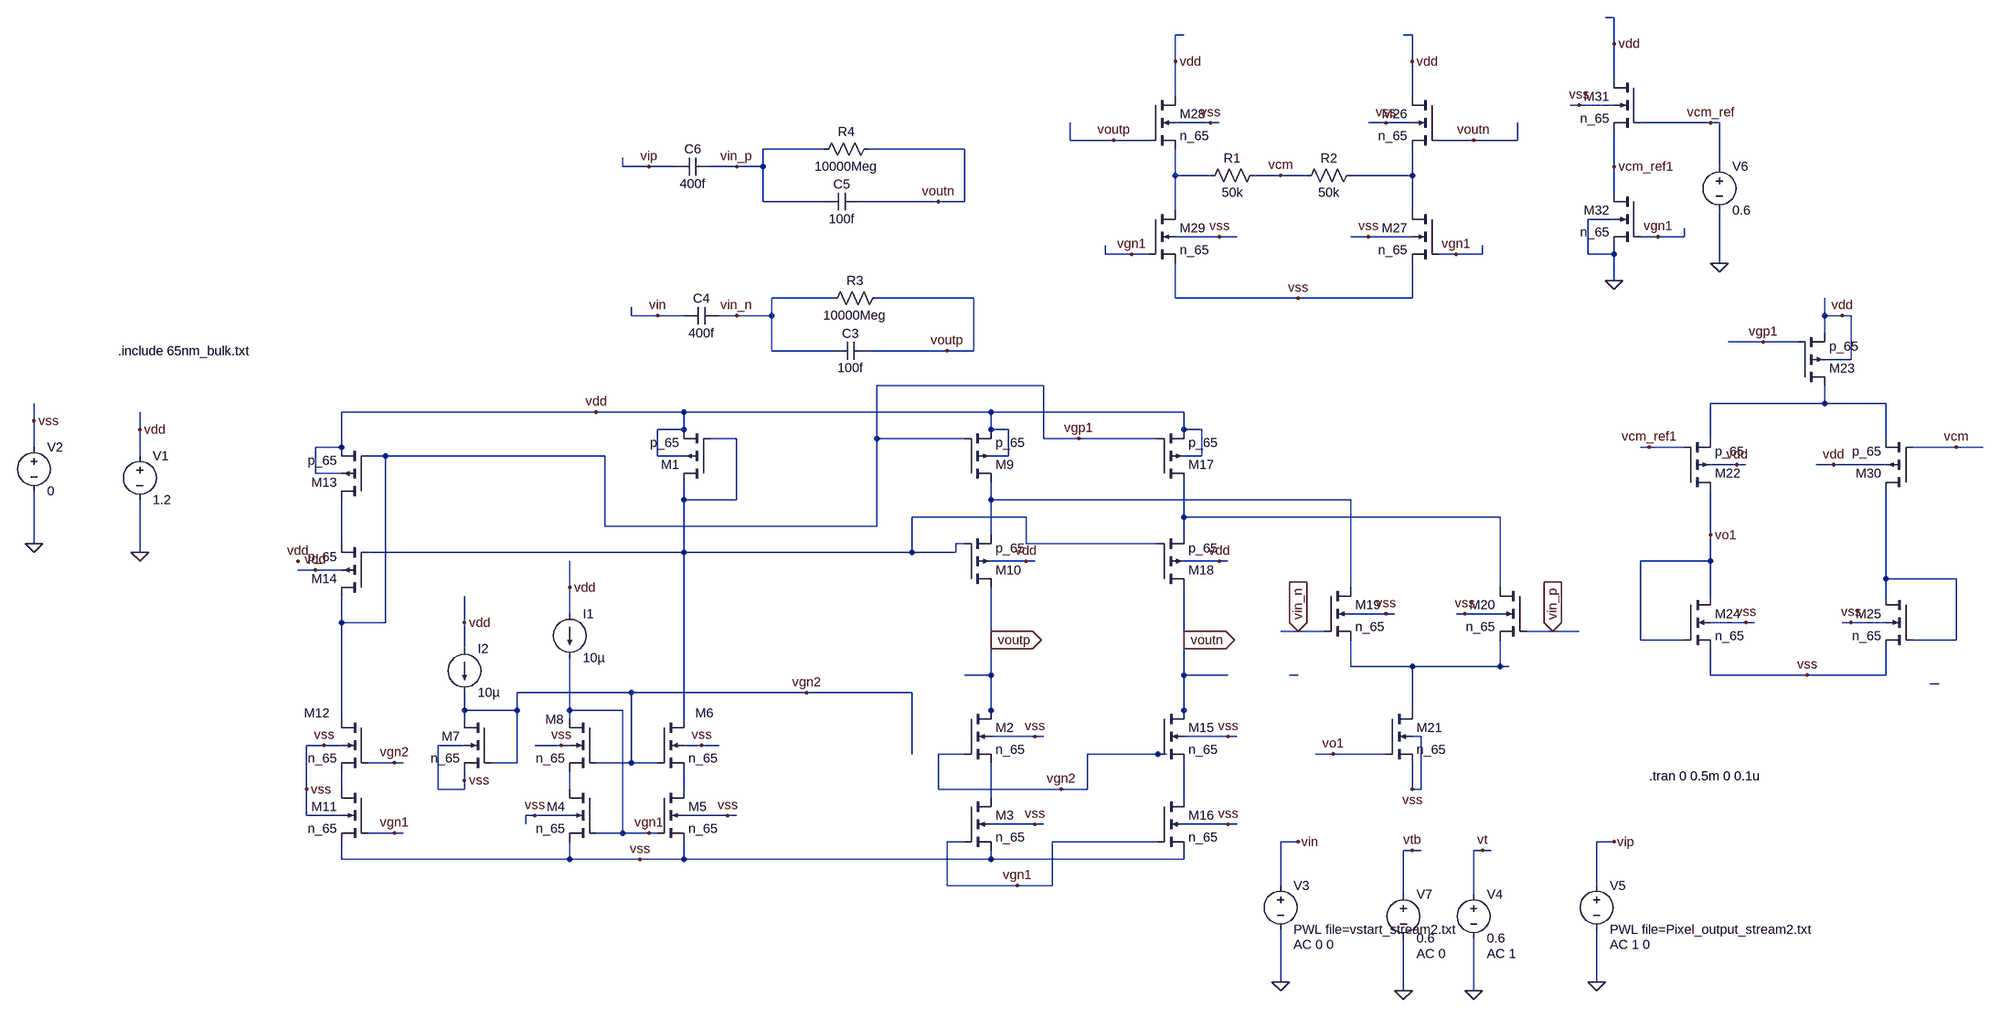
[diagram p0: schematic FullyDiff_STBAnalysis.asc]
FullyDiff_STBAnalysis.asc, the LTspice schematic file:
Version 4
SHEET 1 1972 1008
WIRE 976 -816 960 -816
WIRE 192 -784 176 -784
WIRE 608 -784 592 -784
WIRE 976 -768 976 -816
WIRE 176 -736 176 -784
WIRE 608 -736 608 -784
WIRE 976 -704 976 -768
WIRE 176 -672 176 -736
WIRE 608 -672 608 -736
WIRE 912 -656 896 -656
WIRE 976 -656 912 -656
WIRE 240 -624 176 -624
WIRE 256 -624 240 -624
WIRE 560 -624 528 -624
WIRE 608 -624 560 -624
WIRE 1152 -624 1024 -624
WIRE 1168 -624 1152 -624
WIRE -16 -592 -16 -624
WIRE 64 -592 -16 -592
WIRE 128 -592 64 -592
WIRE 720 -592 656 -592
WIRE 800 -592 800 -624
WIRE 800 -592 720 -592
WIRE -464 -576 -576 -576
WIRE -208 -576 -384 -576
WIRE -832 -544 -832 -560
WIRE -784 -544 -832 -544
WIRE -736 -544 -784 -544
WIRE -624 -544 -672 -544
WIRE -576 -544 -576 -576
WIRE -576 -544 -624 -544
WIRE 976 -544 976 -608
WIRE 1168 -544 1168 -624
WIRE 176 -528 176 -576
WIRE 240 -528 176 -528
WIRE 368 -528 320 -528
WIRE 416 -528 368 -528
WIRE 608 -528 608 -576
WIRE 608 -528 496 -528
WIRE 976 -496 976 -544
WIRE -576 -480 -576 -544
WIRE -464 -480 -576 -480
WIRE -256 -480 -400 -480
WIRE -208 -480 -208 -576
WIRE -208 -480 -256 -480
WIRE 176 -464 176 -528
WIRE 608 -464 608 -528
WIRE 976 -448 928 -448
WIRE 256 -416 176 -416
WIRE 288 -416 256 -416
WIRE 528 -416 496 -416
WIRE 608 -416 528 -416
WIRE 1056 -416 1024 -416
WIRE 1104 -416 1104 -432
WIRE 1104 -416 1056 -416
WIRE 48 -384 48 -400
WIRE 96 -384 48 -384
WIRE 128 -384 96 -384
WIRE 688 -384 656 -384
WIRE 736 -384 736 -400
WIRE 736 -384 688 -384
WIRE 928 -384 928 -448
WIRE 976 -384 976 -400
WIRE 976 -384 928 -384
WIRE 1168 -368 1168 -464
WIRE 976 -336 976 -384
WIRE -448 -304 -560 -304
WIRE -192 -304 -368 -304
WIRE 176 -304 176 -368
WIRE 400 -304 176 -304
WIRE 608 -304 608 -368
WIRE 608 -304 400 -304
WIRE -816 -272 -816 -288
WIRE -768 -272 -816 -272
WIRE -720 -272 -768 -272
WIRE -624 -272 -656 -272
WIRE -560 -272 -560 -304
WIRE -560 -272 -624 -272
WIRE 1360 -272 1360 -304
WIRE 1392 -272 1360 -272
WIRE 1408 -272 1392 -272
WIRE 1360 -240 1360 -272
WIRE 1248 -224 1184 -224
WIRE 1312 -224 1248 -224
WIRE -560 -208 -560 -272
WIRE -448 -208 -560 -208
WIRE -240 -208 -384 -208
WIRE -192 -208 -192 -304
WIRE -192 -208 -240 -208
WIRE 1408 -192 1408 -272
WIRE 1408 -192 1360 -192
WIRE -64 -144 -368 -144
WIRE 1360 -112 1360 -144
WIRE 1360 -112 1152 -112
WIRE 1472 -112 1360 -112
WIRE -880 -96 -1344 -96
WIRE -720 -96 -880 -96
WIRE -160 -96 -720 -96
WIRE 192 -96 -160 -96
WIRE -1920 -80 -1920 -112
WIRE -1712 -64 -1712 -96
WIRE -720 -64 -720 -96
WIRE -720 -64 -768 -64
WIRE -160 -64 -160 -96
WIRE -128 -64 -160 -64
WIRE 192 -64 192 -96
WIRE 224 -64 192 -64
WIRE -624 -48 -672 -48
WIRE -368 -48 -368 -144
WIRE -208 -48 -368 -48
WIRE -64 -48 -64 -144
WIRE 0 -48 -64 -48
WIRE 144 -48 0 -48
WIRE 1152 -48 1152 -112
WIRE 1472 -48 1472 -112
WIRE -1920 -32 -1920 -80
WIRE -1344 -32 -1344 -96
WIRE -1344 -32 -1392 -32
WIRE 1040 -32 1024 -32
WIRE 1104 -32 1040 -32
WIRE 1600 -32 1520 -32
WIRE 1648 -32 1600 -32
WIRE -1712 -16 -1712 -64
WIRE -1344 -16 -1344 -32
WIRE -1264 -16 -1296 -16
WIRE -864 -16 -1264 -16
WIRE -768 -16 -768 -64
WIRE -720 -16 -768 -16
WIRE -128 -16 -128 -64
WIRE -128 -16 -160 -16
WIRE 224 -16 224 -64
WIRE 224 -16 192 -16
WIRE 1200 0 1152 0
WIRE 1216 0 1200 0
WIRE 1376 0 1344 0
WIRE 1472 0 1376 0
WIRE -1392 16 -1392 -32
WIRE -1344 16 -1392 16
WIRE -720 64 -720 32
WIRE -624 64 -624 -48
WIRE -624 64 -720 64
WIRE -160 64 -160 32
WIRE 496 64 -160 64
WIRE -96 96 -304 96
WIRE 192 96 192 32
WIRE 768 96 192 96
WIRE -864 112 -864 -16
WIRE -368 112 -368 -48
WIRE -368 112 -864 112
WIRE -160 128 -160 64
WIRE 192 128 192 96
WIRE 1152 128 1152 48
WIRE -1920 144 -1920 48
WIRE -1344 144 -1344 64
WIRE -208 144 -224 144
WIRE -96 144 -96 96
WIRE 144 144 -96 144
WIRE -1712 160 -1712 64
WIRE -720 160 -720 64
WIRE -720 160 -1296 160
WIRE -304 160 -304 96
WIRE -304 160 -720 160
WIRE -224 160 -224 144
WIRE -224 160 -304 160
WIRE -96 176 -160 176
WIRE -80 176 -96 176
WIRE 256 176 192 176
WIRE 272 176 256 176
WIRE 1152 176 1152 128
WIRE 1152 176 1024 176
WIRE -1392 192 -1424 192
WIRE -1344 192 -1392 192
WIRE 1472 208 1472 48
WIRE 1600 208 1472 208
WIRE -928 224 -928 176
WIRE 496 224 496 64
WIRE 768 224 768 96
WIRE 1152 240 1152 176
WIRE 1472 240 1472 208
WIRE -928 272 -928 224
WIRE 560 272 496 272
WIRE 576 272 560 272
WIRE 704 272 688 272
WIRE 768 272 704 272
WIRE -1344 288 -1344 240
WIRE -1264 288 -1264 -16
WIRE -1264 288 -1344 288
WIRE -1120 288 -1120 240
WIRE 1216 288 1152 288
WIRE 1232 288 1216 288
WIRE 1408 288 1392 288
WIRE 1472 288 1408 288
WIRE 400 304 368 304
WIRE 448 304 400 304
WIRE 864 304 816 304
WIRE 912 304 864 304
WIRE -160 320 -160 224
WIRE 192 320 192 224
WIRE 1024 320 1024 176
WIRE 1104 320 1024 320
WIRE 1600 320 1600 208
WIRE 1600 320 1520 320
WIRE -1120 336 -1120 288
WIRE 496 368 496 320
WIRE 608 368 496 368
WIRE 768 368 768 320
WIRE 768 368 608 368
WIRE 784 368 768 368
WIRE -160 384 -160 320
WIRE -160 384 -208 384
WIRE 192 384 192 320
WIRE 272 384 192 384
WIRE 400 384 384 384
WIRE 1152 384 1152 336
WIRE 1328 384 1152 384
WIRE 1472 384 1472 336
WIRE 1472 384 1328 384
WIRE 1568 400 1552 400
WIRE -816 416 -1024 416
WIRE -496 416 -816 416
WIRE -304 416 -496 416
WIRE -1120 448 -1120 416
WIRE -1024 448 -1024 416
WIRE -1024 448 -1120 448
WIRE -928 448 -928 352
WIRE -832 448 -928 448
WIRE -160 448 -160 384
WIRE 192 448 192 384
WIRE 608 448 608 368
WIRE -1344 464 -1344 288
WIRE -1120 464 -1120 448
WIRE -928 464 -928 448
WIRE -720 464 -720 160
WIRE -160 464 -160 448
WIRE 192 464 192 448
WIRE -80 496 -160 496
WIRE -64 496 -80 496
WIRE 272 496 192 496
WIRE 288 496 272 496
WIRE 624 496 608 496
WIRE -1376 512 -1408 512
WIRE -1344 512 -1376 512
WIRE -1120 512 -1168 512
WIRE -944 512 -992 512
WIRE -928 512 -944 512
WIRE -688 512 -720 512
WIRE -656 512 -688 512
WIRE -304 528 -304 416
WIRE -208 528 -256 528
WIRE 144 528 16 528
WIRE 160 528 144 528
WIRE 464 528 432 528
WIRE 560 528 464 528
WIRE -1248 544 -1296 544
WIRE -1232 544 -1248 544
WIRE -1024 544 -1024 448
WIRE -1024 544 -1072 544
WIRE -816 544 -816 416
WIRE -816 544 -880 544
WIRE -768 544 -816 544
WIRE -1120 576 -1120 560
WIRE -1408 592 -1408 512
WIRE -1344 592 -1344 560
WIRE -1168 592 -1168 512
WIRE -1120 592 -1120 576
WIRE -1120 592 -1168 592
WIRE -928 592 -928 560
WIRE -720 592 -720 560
WIRE -256 592 -256 528
WIRE -32 592 -256 592
WIRE 16 592 16 528
WIRE 16 592 -32 592
WIRE 608 592 608 544
WIRE 624 592 624 496
WIRE 624 592 608 592
WIRE -160 608 -160 544
WIRE 192 608 192 544
WIRE -1408 640 -1408 592
WIRE -1344 640 -1408 640
WIRE -992 640 -1008 640
WIRE -928 640 -992 640
WIRE -640 640 -720 640
WIRE -624 640 -640 640
WIRE -1008 656 -1008 640
WIRE -80 656 -160 656
WIRE -64 656 -80 656
WIRE 272 656 192 656
WIRE 288 656 272 656
WIRE -1248 672 -1296 672
WIRE -1232 672 -1248 672
WIRE -832 672 -832 448
WIRE -832 672 -880 672
WIRE -784 672 -832 672
WIRE -768 672 -784 672
WIRE -208 688 -240 688
WIRE 144 688 -48 688
WIRE 400 688 368 688
WIRE 976 688 944 688
WIRE 608 704 592 704
WIRE 624 704 608 704
WIRE 736 704 720 704
WIRE 752 704 736 704
WIRE -1344 720 -1344 688
WIRE -928 720 -928 688
WIRE -928 720 -1344 720
WIRE -800 720 -928 720
WIRE -720 720 -720 688
WIRE -720 720 -800 720
WIRE -160 720 -160 704
WIRE -160 720 -720 720
WIRE 192 720 192 704
WIRE 192 720 -160 720
WIRE -240 768 -240 688
WIRE -112 768 -240 768
WIRE -48 768 -48 688
WIRE -48 768 -112 768
WIRE 368 768 368 688
WIRE 944 768 944 688
WIRE 592 784 592 704
WIRE 720 784 720 704
WIRE 368 944 368 848
WIRE 944 944 944 848
WIRE 592 960 592 864
WIRE 720 960 720 864
FLAG -928 224 vdd
FLAG -80 496 vss
FLAG -80 656 vss
FLAG -688 512 vss
FLAG -800 720 vss
FLAG -1120 288 vdd
FLAG -1120 576 vss
FLAG -944 512 vss
FLAG -96 176 vdd
FLAG -1376 512 vss
FLAG -1248 672 vgn1
FLAG -1248 544 vgn2
FLAG -880 -96 vdd
FLAG -1712 160 0
FLAG -1712 -64 vdd
FLAG -1920 144 0
FLAG -1920 -80 vss
FLAG -160 320 voutp
IOPIN -160 320 Out
FLAG 272 496 vss
FLAG 272 656 vss
FLAG 256 176 vdd
FLAG 192 320 voutn
IOPIN 192 320 Out
FLAG 560 272 vss
FLAG 704 272 vss
FLAG 608 592 vss
FLAG 1328 384 vss
FLAG 1216 288 vss
FLAG 1408 288 vss
FLAG 1392 -272 vdd
FLAG 1200 0 vdd
FLAG 864 304 vin_p
IOPIN 864 304 In
FLAG 400 304 vin_n
IOPIN 400 304 In
FLAG 0 -48 vgp1
FLAG 368 944 0
FLAG 400 688 vin
FLAG 944 944 0
FLAG 976 688 vip
FLAG -496 416 vgn2
FLAG -112 768 vgn1
FLAG -32 592 vgn2
FLAG 608 -736 vdd
FLAG 688 -384 vgn1
FLAG 720 -592 voutn
FLAG 176 -736 vdd
FLAG 96 -384 vgn1
FLAG 64 -592 voutp
FLAG 400 -304 vss
FLAG 368 -528 vcm
FLAG 1376 0 vdd
FLAG 1600 -32 vcm
FLAG 1248 -224 vgp1
FLAG -784 672 vgn1
FLAG 976 -768 vdd
FLAG 1056 -416 vgn1
FLAG 1168 -368 0
FLAG 1152 -624 vcm_ref
FLAG 976 -544 vcm_ref1
FLAG 1040 -32 vcm_ref1
FLAG 976 -336 0
FLAG 736 704 vt
FLAG 1152 128 vo1
FLAG 464 528 vo1
FLAG -1424 176 vdd
FLAG -1392 192 vdd
FLAG -624 -544 vin_p
FLAG -624 -272 vin_n
FLAG -784 -544 vip
FLAG -768 -272 vin
FLAG 592 960 0
FLAG 608 704 vtb
FLAG 720 960 0
FLAG -256 -480 voutn
FLAG -240 -208 voutp
FLAG 240 -624 vss
FLAG 256 -416 vss
FLAG 528 -416 vss
FLAG 560 -624 vss
FLAG 912 -656 vss
FLAG -1408 592 vss
FLAG -640 640 vss
FLAG -992 640 vss
DATAFLAG -384 416 ""
DATAFLAG -304 160 ""
DATAFLAG -48 -64 ""
DATAFLAG 192 -80 ""
DATAFLAG 1200 -112 ""
DATAFLAG 1152 96 ""
DATAFLAG 1472 160 ""
DATAFLAG -160 272 ""
DATAFLAG 192 272 ""
DATAFLAG 1344 320 ""
DATAFLAG 608 96 ""
DATAFLAG -80 64 ""
DATAFLAG 192 592 ""
DATAFLAG -160 592 ""
DATAFLAG 608 576 ""
DATAFLAG -192 688 ""
DATAFLAG 48 144 ""
DATAFLAG 32 672 ""
DATAFLAG 176 -560 ""
DATAFLAG 608 -544 ""
DATAFLAG 0 -592 ""
DATAFLAG 800 -608 ""
DATAFLAG -1280 544 ""
DATAFLAG -864 544 ""
DATAFLAG -976 -16 ""
DATAFLAG -1024 160 ""
DATAFLAG -1344 80 ""
DATAFLAG 1088 -640 ""
DATAFLAG 1136 208 ""
DATAFLAG 496 112 ""
DATAFLAG 608 416 ""
DATAFLAG 480 512 ""
DATAFLAG 192 272 ""
DATAFLAG -528 -304 ""
DATAFLAG -256 -304 ""
DATAFLAG -224 -528 ""
DATAFLAG -512 -576 ""
DATAFLAG -208 -256 ""
DATAFLAG 688 960 ""
DATAFLAG -1408 512 ""
DATAFLAG -176 384 ""
DATAFLAG 96 -48 ""
DATAFLAG -640 112 ""
DATAFLAG -256 -144 ""
DATAFLAG -432 -96 ""
DATAFLAG 64 688 ""
DATAFLAG 64 528 ""
DATAFLAG -288 -576 "$"
SYMBOL pmos4 -672 32 R180
SYMATTR InstName M1
SYMATTR Value p_65
SYMATTR Value2 l=200n w=2.5u
SYMBOL nmos4 -208 448 R0
SYMATTR InstName M2
SYMATTR Value n_65
SYMATTR Value2 l=200n w=10u
SYMBOL nmos4 -208 608 R0
SYMATTR InstName M3
SYMATTR Value n_65
SYMATTR Value2 l=200n w=10u
SYMBOL nmos4 -880 592 M0
SYMATTR InstName M4
SYMATTR Value n_65
SYMATTR Value2 l=200n w=10u
SYMBOL current -928 272 R0
WINDOW 123 0 0 Left 0
WINDOW 39 0 0 Left 0
SYMATTR InstName I1
SYMATTR Value 10µ
SYMBOL nmos4 -768 592 R0
SYMATTR InstName M5
SYMATTR Value n_65
SYMATTR Value2 l=200n w=10u
SYMBOL nmos4 -768 464 R0
WINDOW 0 69 -11 Left 2
SYMATTR InstName M6
SYMATTR Value n_65
SYMATTR Value2 l=200n w=10u
SYMBOL nmos4 -1072 464 M0
SYMATTR InstName M7
SYMATTR Value n_65
SYMATTR Value2 l=200n w=2.5u
SYMBOL current -1120 336 R0
WINDOW 123 0 0 Left 0
WINDOW 39 0 0 Left 0
SYMATTR InstName I2
SYMATTR Value 10µ
SYMBOL nmos4 -880 464 M0
WINDOW 0 59 1 Left 2
SYMATTR InstName M8
SYMATTR Value n_65
SYMATTR Value2 l=200n w=10u
SYMBOL pmos4 -208 32 M180
SYMATTR InstName M9
SYMATTR Value p_65
SYMATTR Value2 l=200n w=20u
SYMBOL pmos4 -208 224 M180
SYMATTR InstName M10
SYMATTR Value p_65
SYMATTR Value2 l=200n w=10u
SYMBOL nmos4 -1296 592 M0
SYMATTR InstName M11
SYMATTR Value n_65
SYMATTR Value2 l=200n w=10u
SYMBOL nmos4 -1296 464 M0
WINDOW 0 69 -11 Left 2
SYMATTR InstName M12
SYMATTR Value n_65
SYMATTR Value2 l=200n w=10u
SYMBOL pmos4 -1296 64 R180
SYMATTR InstName M13
SYMATTR Value p_65
SYMATTR Value2 l=200n w=10u
SYMBOL pmos4 -1296 240 R180
SYMATTR InstName M14
SYMATTR Value p_65
SYMATTR Value2 l=200n w=10u
SYMBOL voltage -1712 -32 R0
WINDOW 123 0 0 Left 0
WINDOW 39 0 0 Left 0
SYMATTR InstName V1
SYMATTR Value 1.2
SYMBOL voltage -1920 -48 R0
WINDOW 123 0 0 Left 0
WINDOW 39 0 0 Left 0
SYMATTR InstName V2
SYMATTR Value 0
SYMBOL nmos4 144 448 R0
SYMATTR InstName M15
SYMATTR Value n_65
SYMATTR Value2 l=200n w=10u
SYMBOL nmos4 144 608 R0
SYMATTR InstName M16
SYMATTR Value n_65
SYMATTR Value2 l=200n w=10u
SYMBOL pmos4 144 32 M180
SYMATTR InstName M17
SYMATTR Value p_65
SYMATTR Value2 l=200n w=20u
SYMBOL pmos4 144 224 M180
SYMATTR InstName M18
SYMATTR Value p_65
SYMATTR Value2 l=200n w=10u
SYMBOL nmos4 448 224 R0
SYMATTR InstName M19
SYMATTR Value n_65
SYMATTR Value2 l=200n w=80u
SYMBOL nmos4 816 224 M0
SYMATTR InstName M20
SYMATTR Value n_65
SYMATTR Value2 l=200n w=80u
SYMBOL nmos4 560 448 R0
SYMATTR InstName M21
SYMATTR Value n_65
SYMATTR Value2 l=200n w=20u
SYMBOL pmos4 1104 48 M180
SYMATTR InstName M22
SYMATTR Value p_65
SYMATTR Value2 l=65n w=40u
SYMBOL pmos4 1312 -144 M180
SYMATTR InstName M23
SYMATTR Value p_65
SYMATTR Value2 l=200n w=20u
SYMBOL nmos4 1104 240 R0
SYMATTR InstName M24
SYMATTR Value n_65
SYMATTR Value2 l=200n w=10u
SYMBOL nmos4 1520 240 M0
SYMATTR InstName M25
SYMATTR Value n_65
SYMATTR Value2 l=200n w=10u
SYMBOL voltage 368 752 R0
WINDOW 123 24 124 Left 2
WINDOW 39 0 0 Left 0
SYMATTR Value2 AC 0 0
SYMATTR InstName V3
SYMATTR Value PWL file=vstart_stream2.txt
SYMBOL voltage 720 768 R0
WINDOW 123 24 124 Left 2
WINDOW 39 0 0 Left 0
SYMATTR Value2 AC 1
SYMATTR InstName V4
SYMATTR Value 0.6
SYMBOL voltage 944 752 R0
WINDOW 123 24 124 Left 2
WINDOW 39 0 0 Left 0
SYMATTR Value2 AC 1 0
SYMATTR InstName V5
SYMATTR Value PWL file=Pixel_output_stream2.txt
SYMBOL nmos4 656 -672 M0
SYMATTR InstName M26
SYMATTR Value n_65
SYMATTR Value2 l=65n w=20u
SYMBOL nmos4 656 -464 M0
SYMATTR InstName M27
SYMATTR Value n_65
SYMATTR Value2 l=200n w=20u
SYMBOL nmos4 128 -672 R0
SYMATTR InstName M28
SYMATTR Value n_65
SYMATTR Value2 l=65n w=20u
SYMBOL nmos4 128 -464 R0
SYMATTR InstName M29
SYMATTR Value n_65
SYMATTR Value2 l=200n w=20u
SYMBOL res 336 -544 R90
WINDOW 0 0 56 VBottom 2
WINDOW 3 32 56 VTop 2
SYMATTR InstName R1
SYMATTR Value 50k
SYMATTR SpiceLine tol=1 pwr=0.1
SYMBOL res 512 -544 R90
WINDOW 0 0 56 VBottom 2
WINDOW 3 32 56 VTop 2
SYMATTR InstName R2
SYMATTR Value 50k
SYMATTR SpiceLine tol=1 pwr=0.1
SYMBOL pmos4 1520 48 R180
SYMATTR InstName M30
SYMATTR Value p_65
SYMATTR Value2 l=65n w=40u
SYMBOL nmos4 1024 -704 M0
SYMATTR InstName M31
SYMATTR Value n_65
SYMATTR Value2 l=65n w=20u
SYMBOL nmos4 1024 -496 M0
SYMATTR InstName M32
SYMATTR Value n_65
SYMATTR Value2 l=200n w=20u
SYMBOL voltage 1168 -560 R0
WINDOW 123 0 0 Left 0
WINDOW 39 0 0 Left 0
SYMATTR InstName V6
SYMATTR Value 0.6
SYMBOL res -352 -320 R90
WINDOW 0 0 56 VBottom 2
WINDOW 3 32 56 VTop 2
SYMATTR InstName R3
SYMATTR Value 10000Meg
SYMBOL cap -384 -224 R90
WINDOW 0 0 32 VBottom 2
WINDOW 3 32 32 VTop 2
SYMATTR InstName C3
SYMATTR Value 100f
SYMBOL cap -656 -288 R90
WINDOW 0 0 32 VBottom 2
WINDOW 3 32 32 VTop 2
SYMATTR InstName C4
SYMATTR Value 400f
SYMBOL res -368 -592 R90
WINDOW 0 0 56 VBottom 2
WINDOW 3 32 56 VTop 2
SYMATTR InstName R4
SYMATTR Value 10000Meg
SYMBOL cap -400 -496 R90
WINDOW 0 0 32 VBottom 2
WINDOW 3 32 32 VTop 2
SYMATTR InstName C5
SYMATTR Value 100f
SYMBOL cap -672 -560 R90
WINDOW 0 0 32 VBottom 2
WINDOW 3 32 32 VTop 2
SYMATTR InstName C6
SYMATTR Value 400f
SYMBOL voltage 592 768 R0
WINDOW 123 24 124 Left 2
WINDOW 39 0 0 Left 0
SYMATTR Value2 AC 0
SYMATTR InstName V7
SYMATTR Value 0.6
TEXT -1752 -208 Left 2 !.include 65nm_bulk.txt
TEXT 1040 568 Left 2 !.tran 0 0.5m 0 0.1u

The netlist it stands for:
* FullyDiff_STBAnalysis.asc
M1 N004 N004 vdd vdd p_65 l=200n w=2.5u
M2 voutp vgn2 N015 vss n_65 l=200n w=10u
M3 N015 vgn1 vss vss n_65 l=200n w=10u
M4 N013 vgn1 vss vss n_65 l=200n w=10u
I1 vdd vgn1 10µ
M5 N014 vgn1 vss vss n_65 l=200n w=10u
M6 N004 vgn2 N014 vss n_65 l=200n w=10u
M7 vgn2 vgn2 vss vss n_65 l=200n w=2.5u
I2 vdd vgn2 10µ
M8 vgn1 vgn2 N013 vss n_65 l=200n w=10u
M9 N005 vgp1 vdd vdd p_65 l=200n w=20u
M10 voutp N004 N005 vdd p_65 l=200n w=10u
M11 N012 vgn1 vss vss n_65 l=200n w=10u
M12 vgp1 vgn2 N012 vss n_65 l=200n w=10u
M13 N007 vgp1 vdd vdd p_65 l=200n w=10u
M14 vgp1 N004 N007 vdd p_65 l=200n w=10u
V1 vdd 0 1.2
V2 vss 0 0
M15 voutn vgn2 N016 vss n_65 l=200n w=10u
M16 N016 vgn1 vss vss n_65 l=200n w=10u
M17 N006 vgp1 vdd vdd p_65 l=200n w=20u
M18 voutn N004 N006 vdd p_65 l=200n w=10u
M19 N005 vin_n N009 vss n_65 l=200n w=80u
M20 N006 vin_p N009 vss n_65 l=200n w=80u
M21 N009 vo1 vss vss n_65 l=200n w=20u
M22 vo1 vcm_ref1 N003 vdd p_65 l=65n w=40u
M23 N003 vgp1 vdd vdd p_65 l=200n w=20u
M24 vo1 vo1 vss vss n_65 l=200n w=10u
M25 N008 N008 vss vss n_65 l=200n w=10u
V3 vin 0 PWL file=vstart_stream2.txt AC 0 0
V4 vt 0 0.6 AC 1
V5 vip 0 PWL file=Pixel_output_stream2.txt AC 1 0
M26 vdd voutn N002 vss n_65 l=65n w=20u
M27 N002 vgn1 vss vss n_65 l=200n w=20u
M28 vdd voutp N001 vss n_65 l=65n w=20u
M29 N001 vgn1 vss vss n_65 l=200n w=20u
R1 vcm N001 50k tol=1 pwr=0.1
R2 N002 vcm 50k tol=1 pwr=0.1
M30 N008 vcm N003 vdd p_65 l=65n w=40u
M31 vdd vcm_ref vcm_ref1 vss n_65 l=65n w=20u
M32 vcm_ref1 vgn1 0 0 n_65 l=200n w=20u
V6 vcm_ref 0 0.6
R3 voutp vin_n 10000Meg
C3 voutp vin_n 100f
C4 vin_n vin 400f
R4 voutn vin_p 10000Meg
C5 voutn vin_p 100f
C6 vin_p vip 400f
V7 vtb 0 0.6 AC 0
.model NMOS NMOS
.model PMOS PMOS
.lib standard.mos
.include 65nm_bulk.txt
.tran 0 0.5m 0 0.1u
.backanno
.end